# Altium schematic sheet DetectionPart.SchDoc
size A3; ENG_APP_DATE: --/--/--; DSN_APP_DATE: --/--/--; CHK_APP_DATE: --/--/--; Date: 04.01.2021; Organization: Altium Limited; Address1: L3, 12a Rodborough Rd; Address2: Frenchs Forest; Address3: NSW; Address4: Australia 2086; SheetNumber: 2; SheetTotal: 3; Название устройства: Detection Part; Version: 1
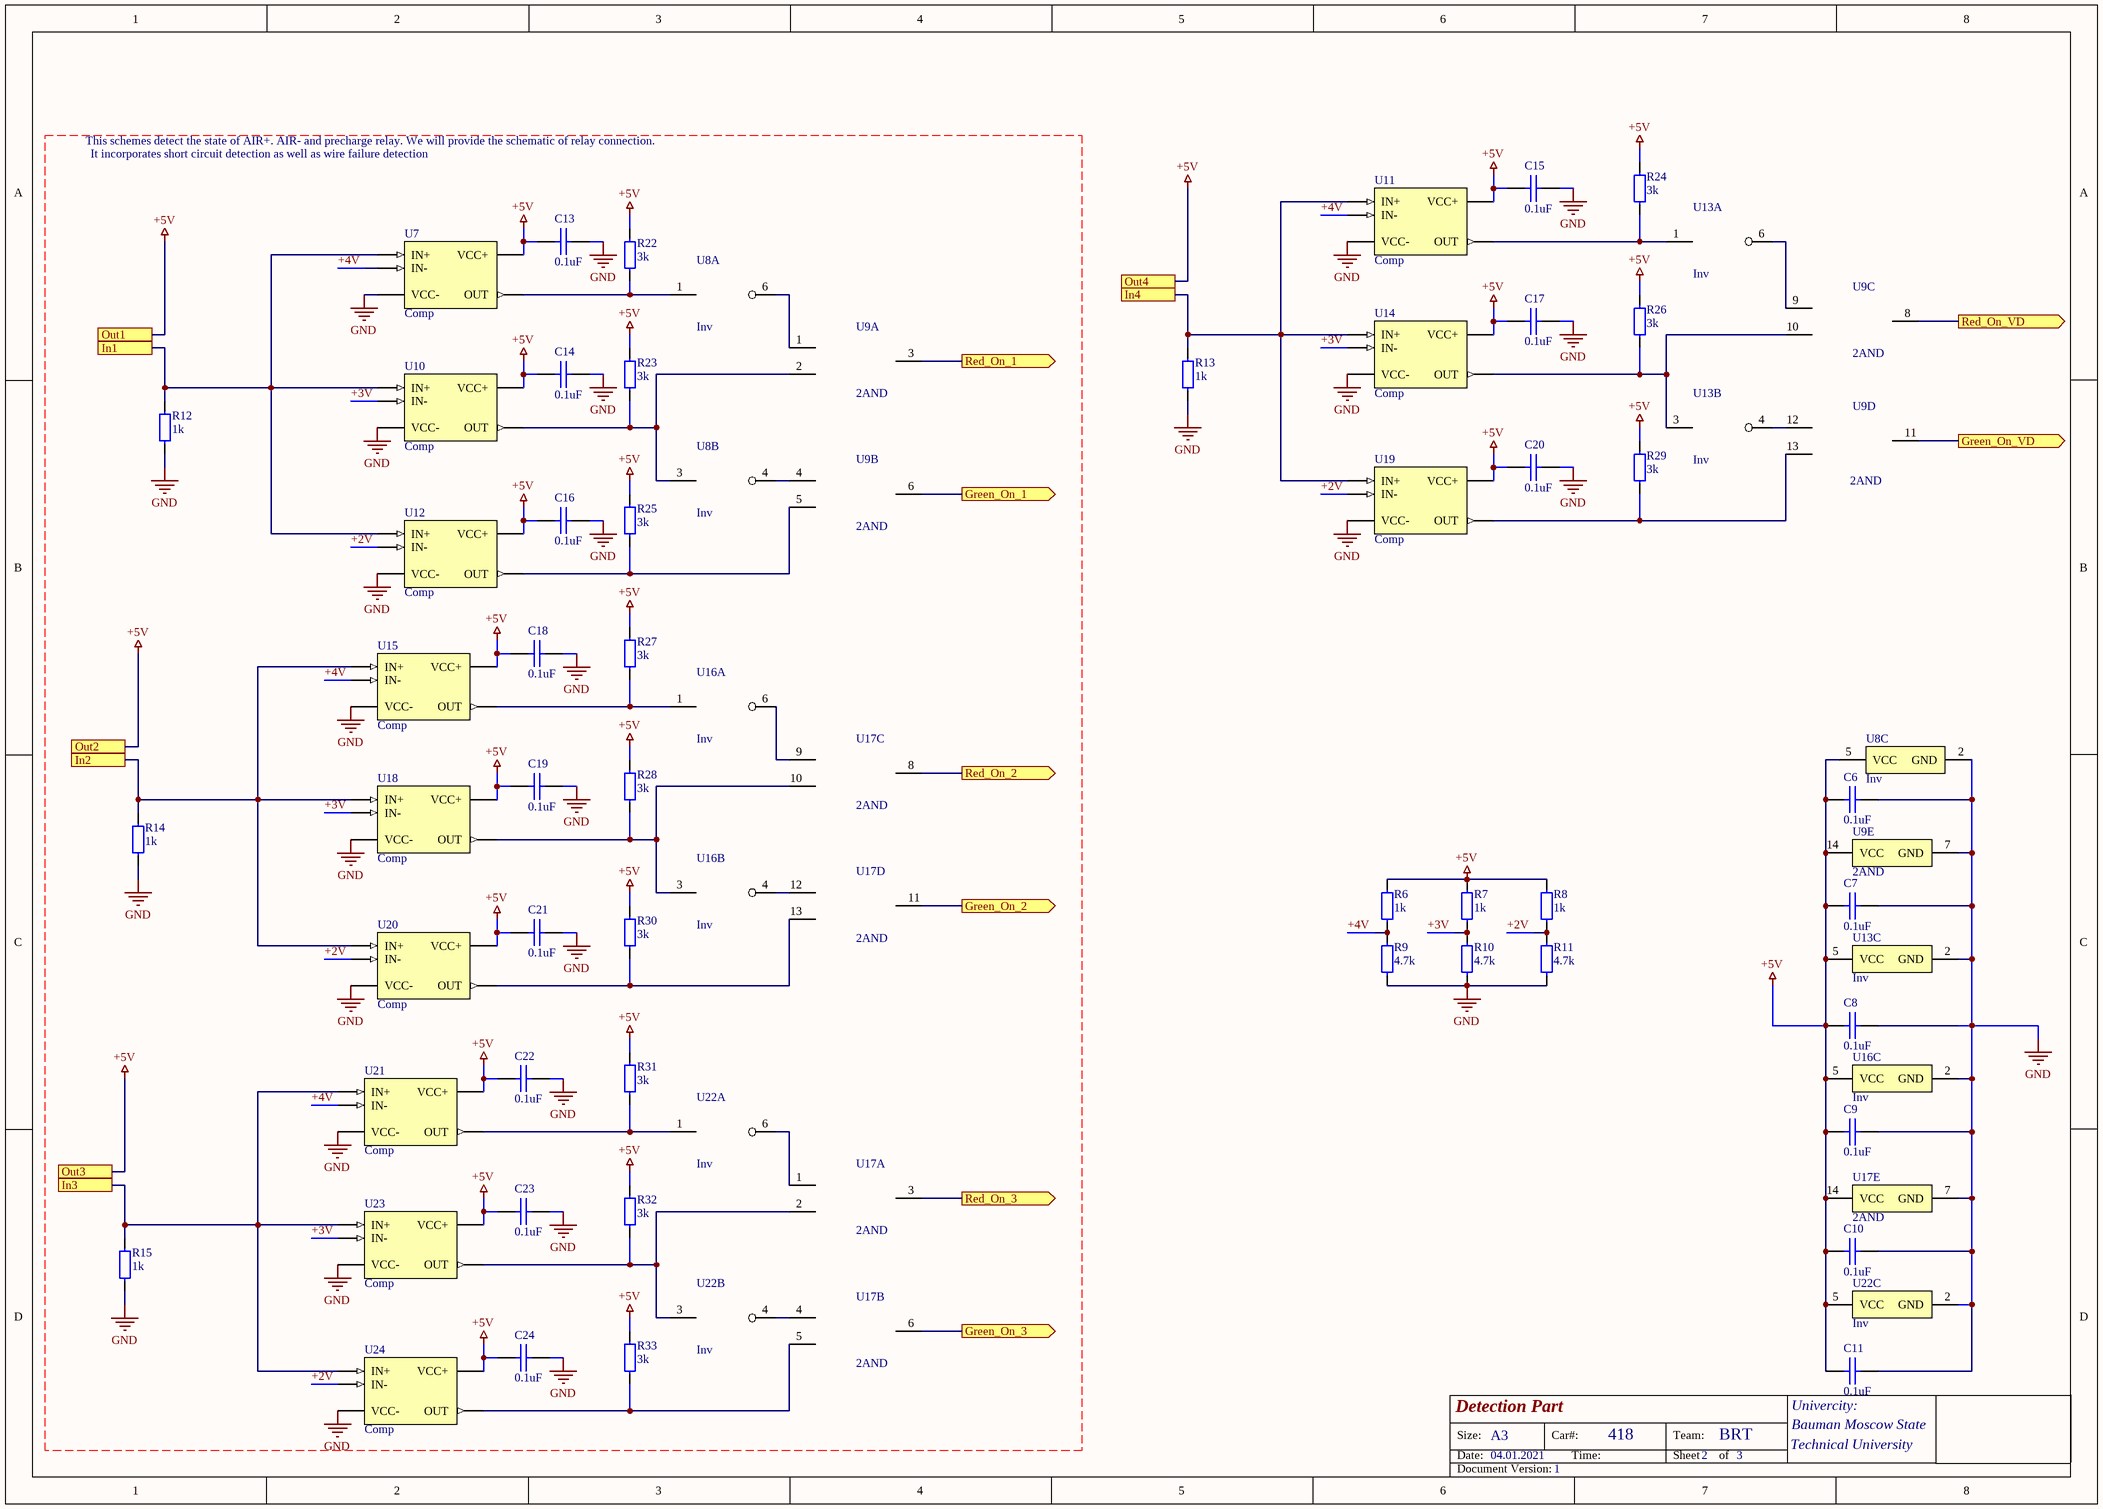
[diagram p0: DetectionPart.SchDoc]

## Parts
C6  0.1uF  [0603 Capicator]
C7  0.1uF  [0603 Capicator]
C8  0.1uF  [0603 Capicator]
C9  0.1uF  [0603 Capicator]
C10  0.1uF  [0603 Capicator]
C11  0.1uF  [0603 Capicator]
C13  0.1uF  [0603 Capicator]
C14  0.1uF  [0603 Capicator]
C15  0.1uF  [0603 Capicator]
C16  0.1uF  [0603 Capicator]
C17  0.1uF  [0603 Capicator]
C18  0.1uF  [0603 Capicator]
C19  0.1uF  [0603 Capicator]
C20  0.1uF  [0603 Capicator]
C21  0.1uF  [0603 Capicator]
C22  0.1uF  [0603 Capicator]
C23  0.1uF  [0603 Capicator]
C24  0.1uF  [0603 Capicator]
R6  1k  [0603 Resistor]
R7  1k  [0603 Resistor]
R8  1k  [0603 Resistor]
R9  4.7k  [0603 Resistor]
R10  4.7k  [0603 Resistor]
R11  4.7k  [0603 Resistor]
R12  1k  [0603 Resistor]
R13  1k  [0603 Resistor]
R14  1k  [0603 Resistor]
R15  1k  [0603 Resistor]
R22  3k  [0603 Resistor]
R23  3k  [0603 Resistor]
R24  3k  [0603 Resistor]
R25  3k  [0603 Resistor]
R26  3k  [0603 Resistor]
R27  3k  [0603 Resistor]
R28  3k  [0603 Resistor]
R29  3k  [0603 Resistor]
R30  3k  [0603 Resistor]
R31  3k  [0603 Resistor]
R32  3k  [0603 Resistor]
R33  3k  [0603 Resistor]
U7  Comp  [SOT-23-5]
U8  Inv  [SOT236]  (parts A,B,C of 3)
U9  2AND  [SOIC-14]  (parts A,B,C,D,E of 5)
U10  Comp  [SOT-23-5]
U11  Comp  [SOT-23-5]
U12  Comp  [SOT-23-5]
U13  Inv  [SOT236]  (parts A,B,C of 3)
U14  Comp  [SOT-23-5]
U15  Comp  [SOT-23-5]
U16  Inv  [SOT236]  (parts A,B,C of 3)
U17  2AND  [SOIC-14]  (parts A,B,C,D,E of 5)
U18  Comp  [SOT-23-5]
U19  Comp  [SOT-23-5]
U20  Comp  [SOT-23-5]
U21  Comp  [SOT-23-5]
U22  Inv  [SOT236]  (parts A,B,C of 3)
U23  Comp  [SOT-23-5]
U24  Comp  [SOT-23-5]

## Ports
Green_On_1 (out), Green_On_2 (out), Green_On_3 (out), Green_On_VD (out), In1, In2, In3, In4, Out1, Out2, Out3, Out4, Red_On_1 (out), Red_On_2 (out), Red_On_3 (out), Red_On_VD (out)

## Nets
+5V: C6.1 C7.2 C8.2 C9.2 C10.2 C11.2 C13.2 C14.2 C15.2 C16.2 C17.2 C18.2 C19.2 C20.2 C21.2 C22.2 C23.2 C24.2 R6.2 R7.2 R8.2 R22.2 R23.2 R24.2 R25.2 R26.2 R27.2 R28.2 R29.2 R30.2 R31.2 R32.2 R33.2 U7.5(VCC+) U8.5(VCC) U9.14(VCC) U10.5(VCC+) U11.5(VCC+) U12.5(VCC+) U13.5(VCC) U14.5(VCC+) U15.5(VCC+) U16.5(VCC) U17.14(VCC) U18.5(VCC+) U19.5(VCC+) U20.5(VCC+) U21.5(VCC+) U22.5(VCC) U23.5(VCC+) U24.5(VCC+) ; port Out1, port Out2, port Out3, port Out4
GND: C6.2 C7.1 C8.1 C9.1 C10.1 C11.1 C13.1 C14.1 C15.1 C16.1 C17.1 C18.1 C19.1 C20.1 C21.1 C22.1 C23.1 C24.1 R9.1 R10.1 R11.1 R12.1 R13.1 R14.1 R15.1 U7.2(VCC-) U8.2(GND) U9.7(GND) U10.2(VCC-) U11.2(VCC-) U12.2(VCC-) U13.2(GND) U14.2(VCC-) U15.2(VCC-) U16.2(GND) U17.7(GND) U18.2(VCC-) U19.2(VCC-) U20.2(VCC-) U21.2(VCC-) U22.2(GND) U23.2(VCC-) U24.2(VCC-)
+2V: R8.1 R11.2 U12.3(IN-) U19.3(IN-) U20.3(IN-) U24.3(IN-)
+3V: R7.1 R10.2 U10.3(IN-) U14.3(IN-) U18.3(IN-) U23.3(IN-)
+4V: R6.1 R9.2 U7.3(IN-) U11.3(IN-) U15.3(IN-) U21.3(IN-)
Green_On_1: U9.6(2Y) ; port Green_On_1
Green_On_2: U17.11(4Y) ; port Green_On_2
Green_On_3: U17.6(2Y) ; port Green_On_3
Green_On_VD: U9.11(4Y) ; port Green_On_VD
In1: R12.2 U7.1(IN+) U10.1(IN+) U12.1(IN+) ; port In1
In2: R14.2 U15.1(IN+) U18.1(IN+) U20.1(IN+) ; port In2
In3: R15.2 U21.1(IN+) U23.1(IN+) U24.1(IN+) ; port In3
In4: R13.2 U11.1(IN+) U14.1(IN+) U19.1(IN+) ; port In4
Red_On_1: U9.3(1Y) ; port Red_On_1
Red_On_2: U17.8(3Y) ; port Red_On_2
Red_On_3: U17.3(1Y) ; port Red_On_3
Red_On_VD: U9.8(3Y) ; port Red_On_VD
NetR22_1: R22.1 U7.4(OUT) U8.1(1A)
NetR23_1: R23.1 U8.3(2А) U9.2(1B) U10.4(OUT)
NetR24_1: R24.1 U11.4(OUT) U13.1(1A)
NetR25_1: R25.1 U9.5(2B) U12.4(OUT)
NetR26_1: R26.1 U9.10(3B) U13.3(2А) U14.4(OUT)
NetR27_1: R27.1 U15.4(OUT) U16.1(1A)
NetR28_1: R28.1 U16.3(2А) U17.10(3B) U18.4(OUT)
NetR29_1: R29.1 U9.13(4B) U19.4(OUT)
NetR30_1: R30.1 U17.13(4B) U20.4(OUT)
NetR31_1: R31.1 U21.4(OUT) U22.1(1A)
NetR32_1: R32.1 U17.2(1B) U22.3(2А) U23.4(OUT)
NetR33_1: R33.1 U17.5(2B) U24.4(OUT)
NetU8_4: U8.4(2Y) U9.4(2A)
NetU8_6: U8.6(1Y) U9.1(1A)
NetU9_9: U9.9(3A) U13.6(1Y)
NetU9_12: U9.12(4A) U13.4(2Y)
NetU16_4: U16.4(2Y) U17.12(4A)
NetU16_6: U16.6(1Y) U17.9(3A)
NetU17_1: U17.1(1A) U22.6(1Y)
NetU17_4: U17.4(2A) U22.4(2Y)

## Notes on the sheet
- This schemes detect the state of AIR+. AIR- and precharge relay. We will provide the schematic of relay connection.
- It incorporates short circuit detection as well as wire failure detection
- Size:
- Date:
- A3
- Car#:
- Time:
- 418
- Team:
- Sheet
- BRT
- of
- Technical University
- Univercity:
- Bauman Moscow State
- Document Version:

## Library data of the parts
C6-C11 C13-C24 = Cap 0.1uF (0603): 0.1uF X7R 16V 10% 0603; Manufacturer: Murata Manufacturing; Part Number: GRM188R71C104KA01D; Type: Capacitor; ComponentLink1Description: Chip&Dip; ComponentLink1URL: https://www.chipdip.ru/product/grm188r71c104ka01d
R6-R8 R12-R15 = Res 1k (0603): 0.1W 0603 1k, 1%; Part Number: RC0603FR-071KL; Manufacturer: Taiwan; Type: Resistor; ComponentLink1Description: Chip&Dip; ComponentLink1URL: https://www.chipdip.ru/product0/9000079676
R9-R11 = Res 4.7k (0603): 0.1W 0603 4.7k, 1%; Part Number: RC0603FR-074K7L; Manufacturer: Taiwan; Type: Resistor; ComponentLink1Description: Chip&Dip; ComponentLink1URL: https://www.chipdip.ru/product0/9000079728
R22-R33 = Res 3k (0603): 0.1W 0603 3k, 1%; Part Number: RC0603FR-073KL; Manufacturer: Taiwan; Type: Resistor; ComponentLink1Description: Chip&Dip; ComponentLink1URL: https://www.chipdip.ru/product0/9000079723
U7 U10-U12 U14 U15 U18-U21 U23 U24 = Comparator [LMV]: Differential comparator with strobes; Part Number: LMV331M5/NOPB; Manufacturer: Texas Instruments; ComponentLink1Description: DataSheet; ComponentLink1URL: https://static.chipdip.ru/lib/291/DOC000291302.pdf; ComponentLink2Description: Chip&Dip; ComponentLink2URL: https://www.chipdip.ru/product/lmv331m5-nopb; Type: IC
U8 U13 U16 U22 = Inverter (SN74): Dual inverter, 1.65-5.5V; Manufacturer: Texas Instruments; Part Number: SN74LVC2G04DBVR; ComponentLink1Description: Chip&Dip; ComponentLink1URL: https://www.chipdip.ru/product/sn74lvc2g04dbvr-2; ComponentLink2Description: DataSheet; ComponentLink2URL: https://static.chipdip.ru/lib/021/DOC001021810.pdf; Type: IC
U9 U17 = 2And: 4 logic elements "2AND"; Part Number: SN74AC08DR; Manufacturer: Texas Instruments; ComponentLink1Description: DataSheet; ComponentLink1URL: https://static.chipdip.ru/lib/551/DOC001551527.pdf; ComponentLink2Description: Chip&Dip; ComponentLink2URL: https://www.chipdip.ru/product/sn74ac08dr; Type: IC